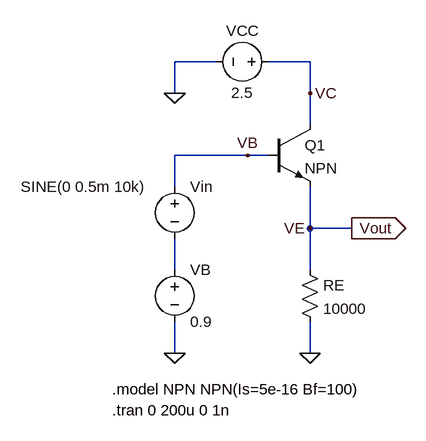
[diagram p0: schematic HW2 2-a.asc]
HW2 2-a.asc, the LTspice schematic file:
Version 4
SHEET 1 880 680
WIRE 208 -288 144 -288
WIRE 352 -288 288 -288
WIRE 144 -240 144 -288
WIRE 352 -240 352 -288
WIRE 352 -192 352 -240
WIRE 256 -144 144 -144
WIRE 288 -144 256 -144
WIRE 144 -96 144 -144
WIRE 352 -32 352 -96
WIRE 416 -32 352 -32
WIRE 144 32 144 -16
WIRE 352 32 352 -32
WIRE 144 160 144 112
WIRE 352 160 352 112
FLAG 144 160 0
FLAG 352 160 0
FLAG 144 -240 0
FLAG 256 -144 VB
FLAG 352 -240 VC
FLAG 416 -32 Vout
IOPIN 416 -32 Out
FLAG 352 -32 VE
SYMBOL voltage 144 16 R0
SYMATTR InstName VB
SYMATTR Value 0.9
SYMBOL voltage 144 -112 R0
WINDOW 3 -237 16 Left 2
WINDOW 123 0 0 Left 0
WINDOW 39 0 0 Left 0
SYMATTR Value SINE(0 0.5m 10k)
SYMATTR InstName Vin
SYMBOL npn 288 -192 R0
SYMATTR InstName Q1
SYMBOL voltage 304 -288 R90
WINDOW 0 -32 56 VBottom 2
WINDOW 3 32 56 VTop 2
SYMATTR InstName VCC
SYMATTR Value 2.5
SYMBOL res 336 16 R0
SYMATTR InstName RE
SYMATTR Value 10000
TEXT 48 216 Left 2 !.model NPN NPN(Is=5e-16 Bf=100)
TEXT 48 248 Left 2 !.tran 0 200u 0 1n

The netlist it stands for:
* HW2 2-a.asc
VB N001 0 0.9
Vin VB N001 SINE(0 0.5m 10k)
Q1 VC VB VE 0 NPN
VCC VC 0 2.5
RE VE 0 10000
.model NPN NPN
.model PNP PNP
.lib standard.bjt
.model NPN NPN(Is=5e-16 Bf=100)
.tran 0 200u 0 1n
.backanno
.end